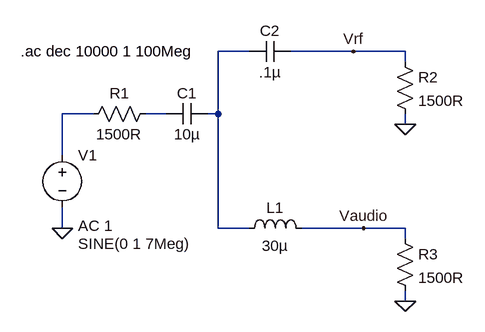
[diagram p0: schematic No Switch.asc]
No Switch.asc, the LTspice schematic file:
Version 4
SHEET 1 1048 680
WIRE 288 0 240 0
WIRE 448 0 352 0
WIRE 528 0 448 0
WIRE 528 16 528 0
WIRE 48 96 0 96
WIRE 160 96 128 96
WIRE 240 96 240 0
WIRE 240 96 224 96
WIRE 528 112 528 96
WIRE 0 160 0 96
WIRE 0 272 0 240
WIRE 240 272 240 96
WIRE 288 272 240 272
WIRE 464 272 368 272
WIRE 528 272 464 272
WIRE 528 288 528 272
WIRE 528 384 528 368
FLAG 528 112 0
FLAG 528 384 0
FLAG 0 272 0
FLAG 448 0 Vrf
FLAG 464 272 Vaudio
SYMBOL voltage 0 144 R0
WINDOW 3 24 152 Left 2
WINDOW 123 24 124 Left 2
WINDOW 39 0 0 Left 2
SYMATTR InstName V1
SYMATTR Value SINE(0 1 7Meg)
SYMATTR Value2 AC 1
SYMBOL cap 224 80 R90
WINDOW 0 0 32 VBottom 2
WINDOW 3 32 32 VTop 2
SYMATTR InstName C1
SYMATTR Value 10µ
SYMBOL res 144 80 R90
WINDOW 0 0 56 VBottom 2
WINDOW 3 32 56 VTop 2
SYMATTR InstName R1
SYMATTR Value 1500R
SYMBOL ind 272 288 R270
WINDOW 0 32 56 VTop 2
WINDOW 3 5 56 VBottom 2
SYMATTR InstName L1
SYMATTR Value 30µ
SYMBOL cap 352 -16 R90
WINDOW 0 0 32 VBottom 2
WINDOW 3 32 32 VTop 2
SYMATTR InstName C2
SYMATTR Value .1µ
SYMBOL res 512 0 R0
SYMATTR InstName R2
SYMATTR Value 1500R
SYMBOL res 512 272 R0
SYMATTR InstName R3
SYMATTR Value 1500R
TEXT -64 0 Left 2 !.ac dec 10000 1 100Meg

The netlist it stands for:
* No Switch.asc
V1 N002 0 SINE(0 1 7Meg) AC 1
C1 N001 N003 10µ
R1 N003 N002 1500R
L1 N001 Vaudio 30µ
C2 Vrf N001 .1µ
R2 Vrf 0 1500R
R3 Vaudio 0 1500R
.ac dec 10000 1 100Meg
.backanno
.end